# Altium schematic sheet Startracker_mainboard.SchDoc
size A3; SheetNumber: 1; SheetTotal: 1
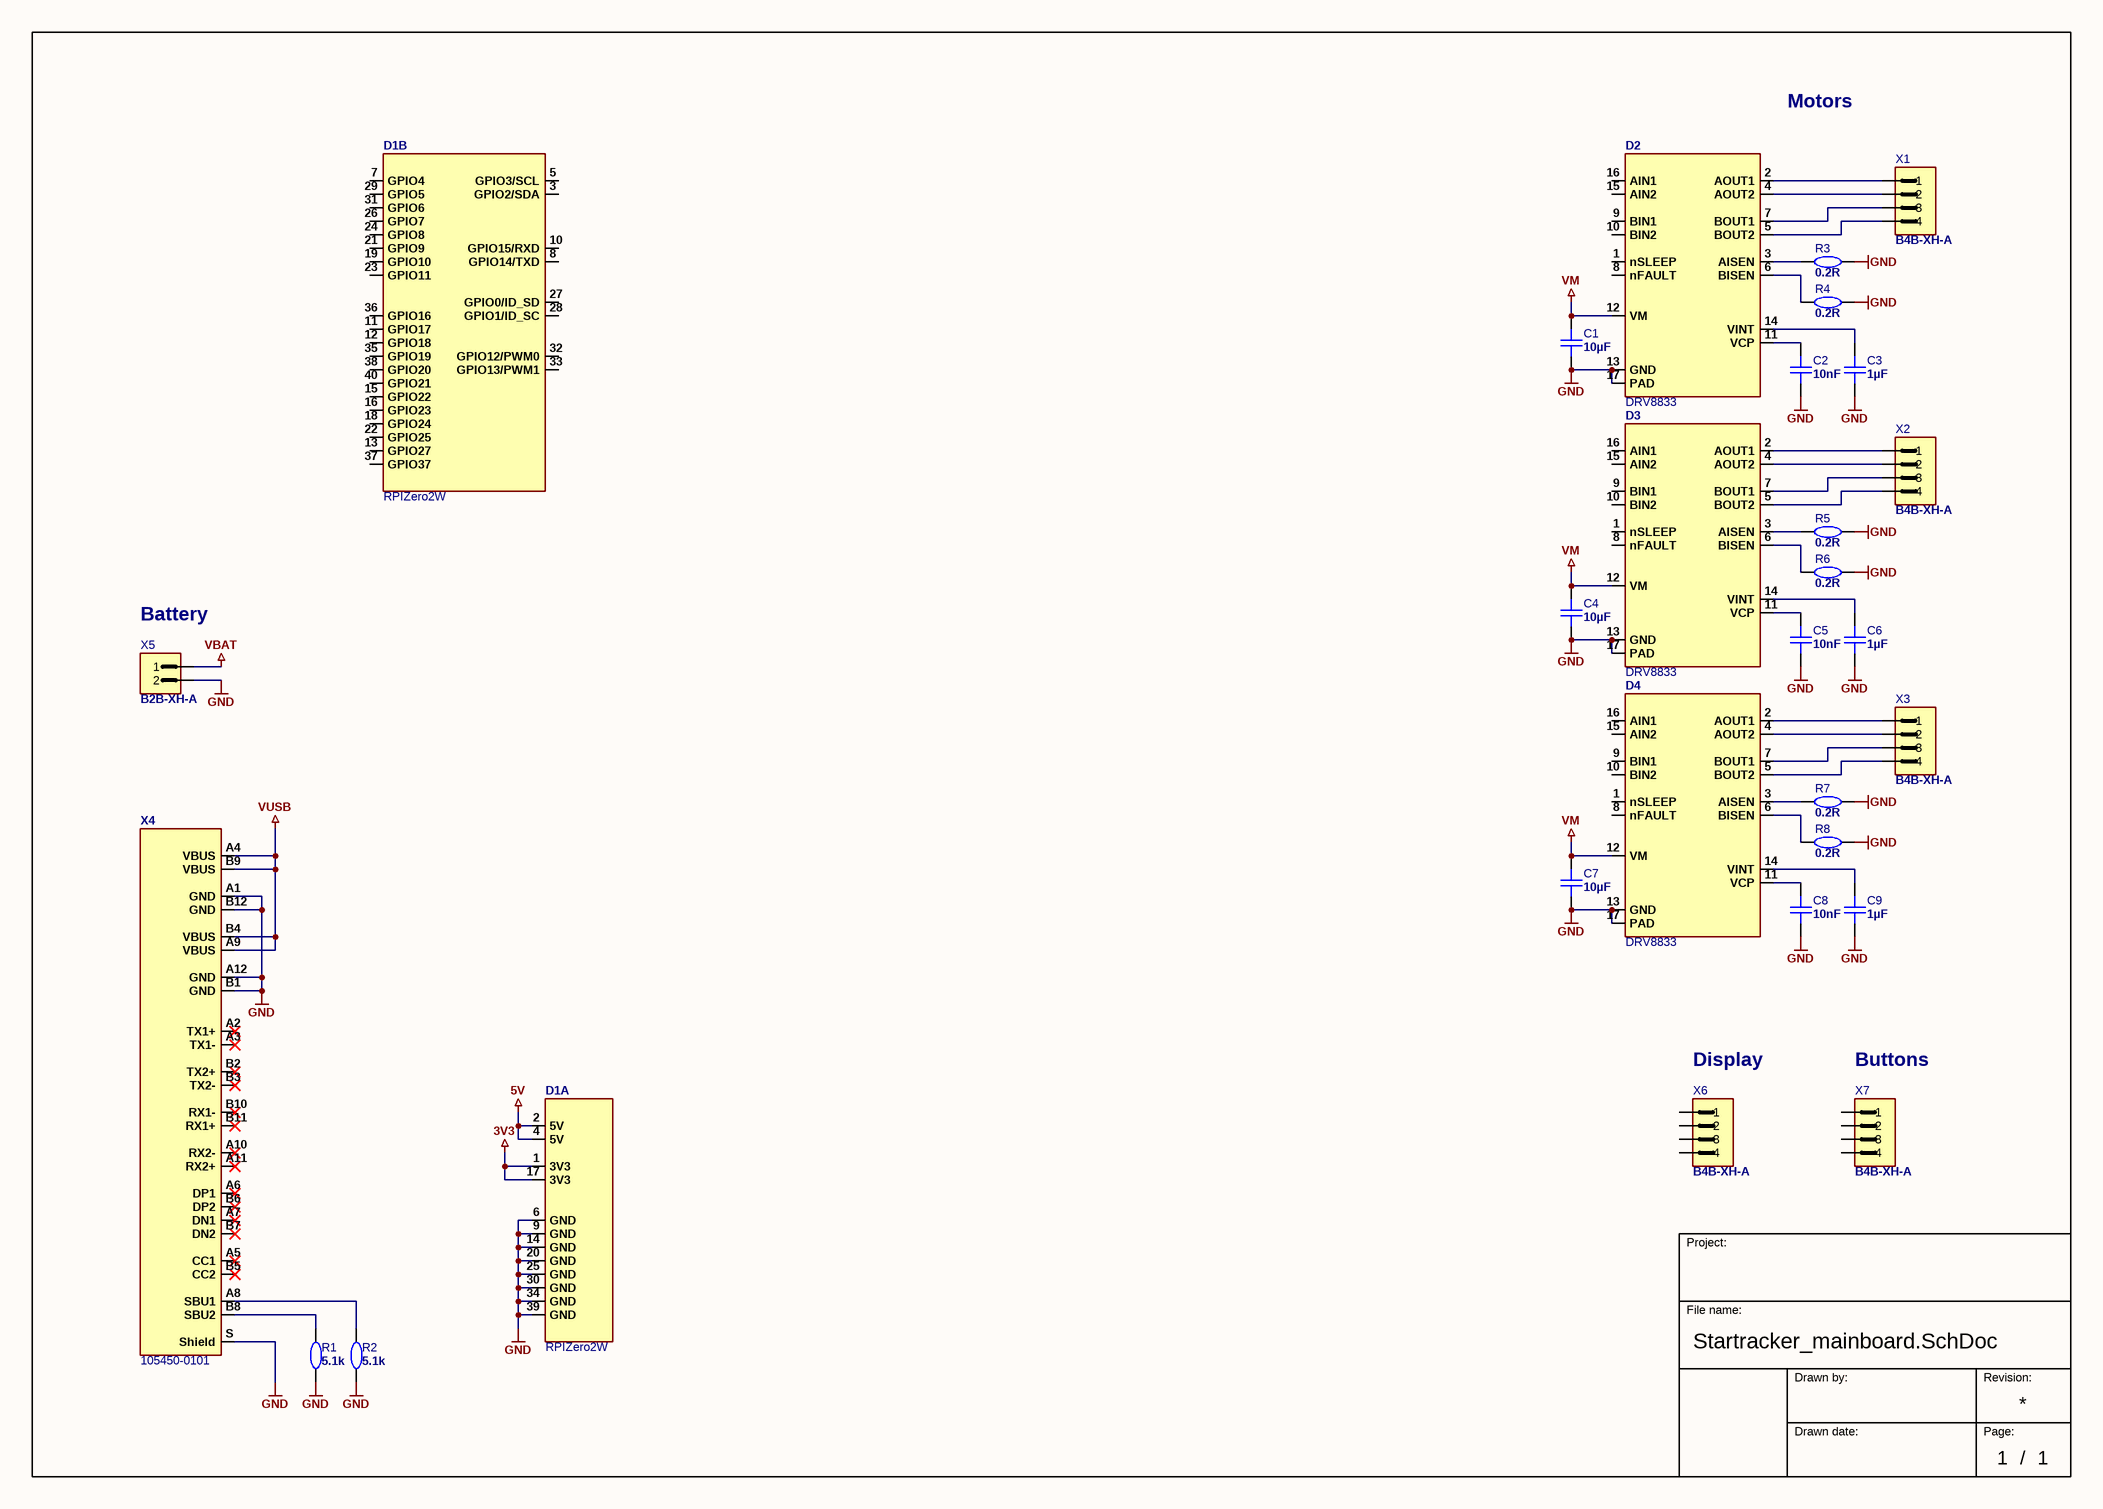
[diagram p0: Startracker_mainboard.SchDoc]

## Parts
C1  value 10µF  [C-0805_2012_145_L_RF]  (hidden comment: Cap 10u 16V 0805)
C2  value 10nF  [C-0603_1608_095_L_RF]  (hidden comment: Cap 10n 0603)
C3  value 1µF  [C-0603_1608_095_L_RF]  (hidden comment: Cap 1u 0603)
C4  value 10µF  [C-0805_2012_145_L_RF]  (hidden comment: Cap 10u 16V 0805)
C5  value 10nF  [C-0603_1608_095_L_RF]  (hidden comment: Cap 10n 0603)
C6  value 1µF  [C-0603_1608_095_L_RF]  (hidden comment: Cap 1u 0603)
C7  value 10µF  [C-0805_2012_145_L_RF]  (hidden comment: Cap 10u 16V 0805)
C8  value 10nF  [C-0603_1608_095_L_RF]  (hidden comment: Cap 10n 0603)
C9  value 1µF  [C-0603_1608_095_L_RF]  (hidden comment: Cap 1u 0603)
D1  RPIZero2W  [RPIZero2W]  (parts A,B of 2)
D2  DRV8833  [TSSOP16-Power_N_RF]
D3  DRV8833  [TSSOP16-Power_N_RF]
D4  DRV8833  [TSSOP16-Power_N_RF]
R1  value 5.1k  [R-0603_1608_050_L_RF]  (hidden comment: Res 5k1 0603)
R2  value 5.1k  [R-0603_1608_050_L_RF]  (hidden comment: Res 5k1 0603)
R3  value 0.2R  [R-2512_6432_065_L_RF]  (hidden comment: Res 0R2 2512)
R4  value 0.2R  [R-2512_6432_065_L_RF]  (hidden comment: Res 0R2 2512)
R5  value 0.2R  [R-2512_6432_065_L_RF]  (hidden comment: Res 0R2 2512)
R6  value 0.2R  [R-2512_6432_065_L_RF]  (hidden comment: Res 0R2 2512)
R7  value 0.2R  [R-2512_6432_065_L_RF]  (hidden comment: Res 0R2 2512)
R8  value 0.2R  [R-2512_6432_065_L_RF]  (hidden comment: Res 0R2 2512)
X1  value B4B-XH-A  [X-0124X0057-R_M04_P0250_JST_B4B-XH-A]  (hidden comment: CONN HEADER XH 4POS THT)
X2  value B4B-XH-A  [X-0124X0057-R_M04_P0250_JST_B4B-XH-A]  (hidden comment: CONN HEADER XH 4POS THT)
X3  value B4B-XH-A  [X-0124X0057-R_M04_P0250_JST_B4B-XH-A]  (hidden comment: CONN HEADER XH 4POS THT)
X4  105450-0101  [105450-0101]
X5  value B2B-XH-A  [X-0074X0057-R_M02_P0250_JST_B2B-XH-A]  (hidden comment: CONN HEADER XH 2POS THT)
X6  value B4B-XH-A  [X-0124X0057-R_M04_P0250_JST_B4B-XH-A]  (hidden comment: CONN HEADER XH 4POS THT)
X7  value B4B-XH-A  [X-0124X0057-R_M04_P0250_JST_B4B-XH-A]  (hidden comment: CONN HEADER XH 4POS THT)

## Nets
3V3: D1.1(3V3) D1.17(3V3)
5V: D1.2(5V) D1.4(5V)
GND: C1.1 C2.1 C3.1 C4.1 C5.1 C6.1 C7.1 C8.1 C9.1 D1.6(GND) D1.9(GND) D1.14(GND) D1.20(GND) D1.25(GND) D1.30(GND) D1.34(GND) D1.39(GND) D2.13(GND) D2.17(PAD) D3.13(GND) D3.17(PAD) D4.13(GND) D4.17(PAD) R1.1 R2.1 R3.1 R4.1 R5.1 R6.1 R7.1 R8.1 X4.A1(GND) X4.A12(GND) X4.B1(GND) X4.B12(GND) X4.S(Shield) X5.2
VBAT: X5.1
VM: C1.2 C4.2 C7.2 D2.12(VM) D3.12(VM) D4.12(VM)
VUSB: X4.A4(VBUS) X4.A9(VBUS) X4.B4(VBUS) X4.B9(VBUS)
NetC2_2: C2.2 D2.11(VCP)
NetC3_2: C3.2 D2.14(VINT)
NetC5_2: C5.2 D3.11(VCP)
NetC6_2: C6.2 D3.14(VINT)
NetC8_2: C8.2 D4.11(VCP)
NetC9_2: C9.2 D4.14(VINT)
NetD2_2: D2.2(AOUT1) X1.1
NetD2_3: D2.3(AISEN) R3.2
NetD2_4: D2.4(AOUT2) X1.2
NetD2_5: D2.5(BOUT2) X1.4
NetD2_6: D2.6(BISEN) R4.2
NetD2_7: D2.7(BOUT1) X1.3
NetD3_2: D3.2(AOUT1) X2.1
NetD3_3: D3.3(AISEN) R5.2
NetD3_4: D3.4(AOUT2) X2.2
NetD3_5: D3.5(BOUT2) X2.4
NetD3_6: D3.6(BISEN) R6.2
NetD3_7: D3.7(BOUT1) X2.3
NetD4_2: D4.2(AOUT1) X3.1
NetD4_3: D4.3(AISEN) R7.2
NetD4_4: D4.4(AOUT2) X3.2
NetD4_5: D4.5(BOUT2) X3.4
NetD4_6: D4.6(BISEN) R8.2
NetD4_7: D4.7(BOUT1) X3.3
NetR1_2: R1.2 X4.B8(SBU2)
NetR2_2: R2.2 X4.A8(SBU1)

Not connected (* = marked no-connect by the designer): D1 3(GPIO2/SDA) 5(GPIO3/SCL) 7(GPIO4) 8(GPIO14/TXD) 10(GPIO15/RXD) 11(GPIO17) 12(GPIO18) 13(GPIO27) 15(GPIO22) 16(GPIO23) 18(GPIO24) 19(GPIO10) 21(GPIO9) 22(GPIO25) 23(GPIO11) 24(GPIO8) 26(GPIO7) 27(GPIO0/ID_SD) 28(GPIO1/ID_SC) 29(GPIO5) 31(GPIO6) 32(GPIO12/PWM0) 33(GPIO13/PWM1) 35(GPIO19) 36(GPIO16) 37(GPIO37) 38(GPIO20) 40(GPIO21); D2 1(nSLEEP) 8(nFAULT) 9(BIN1) 10(BIN2) 15(AIN2) 16(AIN1); D3 1(nSLEEP) 8(nFAULT) 9(BIN1) 10(BIN2) 15(AIN2) 16(AIN1); D4 1(nSLEEP) 8(nFAULT) 9(BIN1) 10(BIN2) 15(AIN2) 16(AIN1); X4 A2(TX1+)* A3(TX1-)* A5(CC1)* A6(DP1)* A7(DN1)* A10(RX2-)* A11(RX2+)* B2(TX2+)* B3(TX2-)* B5(CC2)* B6(DP2)* B7(DN2)* B10(RX1-)* B11(RX1+)*; X6 1 2 3 4; X7 1 2 3 4

## Notes on the sheet
- Motors
- (near X5) Battery
- (near X6) Display
- (near X7) Buttons
- Project:
- File name:
- Drawn by:
- Revision:
- Drawn date:
- Page:
- /

## Library data of the parts
C1 C4 C7 = CMP-001-0196-2: Cap Cer SMD 10u 16V 10% 0805 X5R; Manufacturer: Yageo; Manufacturer Part Number: CC0805KKX5R6BB106; Prefered: true; GPV_Number: 1750.0241; User: zupa; PartStatus: Release; ComponentLink1Description: Datasheet; Case / Package: 0805; ComponentLink1URL: http://www.yageo.com/documents/recent/UPY-GPHC_X5R_4V-to-50V_25.pdf; ClassName: Surface_Assy; Technology: SMT
C2 C5 C8 = CMP-001-0040-2: Cap Cer SMD 10n 50V 10% 0603 X7R; Manufacturer Part Number: GRM188R71H103KA01D; Manufacturer: MURATA; User: zupa; MNL_Number: 22310403; Prefered: true; GPV_Number: 1749.0004; ComponentLink1URL: https://datasheet.ciiva.com/11786/0900766b8003061f-11786516.pdf; Technology: SMT; Case / Package: 0603; ClassName: Surface_Assy; PartStatus: Release; ComponentLink1Description: Datasheet
C3 C6 C9 = CMP-001-0045-2: Cap Cer SMD 1u 16V 10% 0603 X7R; Manufacturer Part Number: 0603YC105KAT*; Manufacturer: AVX; Prefered: true; User: zupa; GPV_Number: 1749.0125; MNL_Number: 22310613; ComponentLink1Description: Datasheet; ClassName: Surface_Assy; PartStatus: Release; Case / Package: 0603; ComponentLink1URL: https://datasheet.ciiva.com/11464/ccog-11464569.pdf; Technology: SMT
D1 = RPI Zero 2W: Raspberry Pi Zero 2W; Part_validated: No; Manufacturer Part Number: Zero 2W; GPV_Number: xxxx.xxxx; MNL_Number: xxxxxxxx; Value: RPIZero2W; Footprint_validated: No; PartStatus: New; System: -; Case/Package: -; Technology: THT; Manufacturer: Raspberry Pi; ClassName: Through-Hole_Assy
D2-D4 = DRV8833: IC Driver Dual H-Bridge 1.5A 2.7-10.8V; Part_validated: No; Manufacturer: Texas Instruments; Manufacturer Part Number: DRV8833P; GPV_Number: xxxx.xxxx; MNL_Number: xxxxxxxx; Value: DRV8833; Footprint_validated: No; PartStatus: New; System: -; ClassName: Surface_Assy; Case/Package: TSSOP16; Technology: SMT
R1 R2 = CMP-001-0582-3: Res SMD 5k1 1% 0.1W 0603; Manufacturer Part Number: RC0603FR-075K1L; Manufacturer: YAGEO; Prefered: true; GPV_Number: 1922.0144; User: napa; Technology: SMT; ComponentLink1URL: https://datasheet.ciiva.com/8895/pyu-rc0603-51-rohs-l-4-8895189.pdf; PartStatus: Release; ClassName: Surface_Assy; ComponentLink1Description: Datasheet; Case / Package: 0603
R3-R8 = CMP-001-0329-4: Res SMD 0R2 1% 1W 2512; Manufacturer Part Number: SR733ATTER200F; Manufacturer: KOA; User: zupa; GPV_Number: 1931.0042; Prefered: false; PartStatus: Release; Technology: SMT; ComponentLink1URL: https://datasheet.ciiva.com/5470/sr73-5470539.pdf; Case / Package: 2512; ClassName: Surface_Assy; ComponentLink1Description: Datasheet
X1-X3 X6 X7 = CMP-00142-2: CONN HEADER  4POS_JST_B4B-XH; Manufacturer: JST; System: Connector; User: balu; ClassName: Through-Hole_Assy; Technology: THT; Manufacturer Part Number: B4B-XH-A; PartStatus: Release; GPV_Number: *
X4 = 105450-0101: CONN USB-C 16pin; Part_validated: No; Manufacturer: Molex; GPV_Number: xxxx.xxxx; System: Connector; MNL_Number: xxxxxxxx; Value: 105450-0101; Footprint_validated: No; PartStatus: New; ClassName: Through-Hole_Assy; Case/Package: USB-C; Technology: SMT; Manufacturer Part Number: 105450-0101
X5 = CMP-00140-2: CONN HEADER  2POS_JST_B2B-XH; Manufacturer: JST; User: balu; System: Connector; GPV_Number: *; Manufacturer Part Number: B2B-XH-A; PartStatus: Release; Technology: THT; ClassName: Through-Hole_Assy